# Altium schematic sheet Main.SchDoc
size A; Engineer: Hoang Pham; SheetNumber: 1; SheetTotal: 4; PageSetup: Record=PageOptions|CenterHorizontal=True|CenterVertical=True|PrintScale=1.00|XCorrection=1.00|YCorrection=1.00|PrintKind=1|BorderSize=5000000|LeftOffset=0|BottomOffset=0|Orientation=2|PaperLength=1000|PaperWidth=1000|Scale=100|PaperSource=7|PrintQuality=-3|MediaType=1|DitherType=10|PrintScaleMode=1|PaperKind=Letter 8.5"x11" 22x28cm|PaperIndex=1
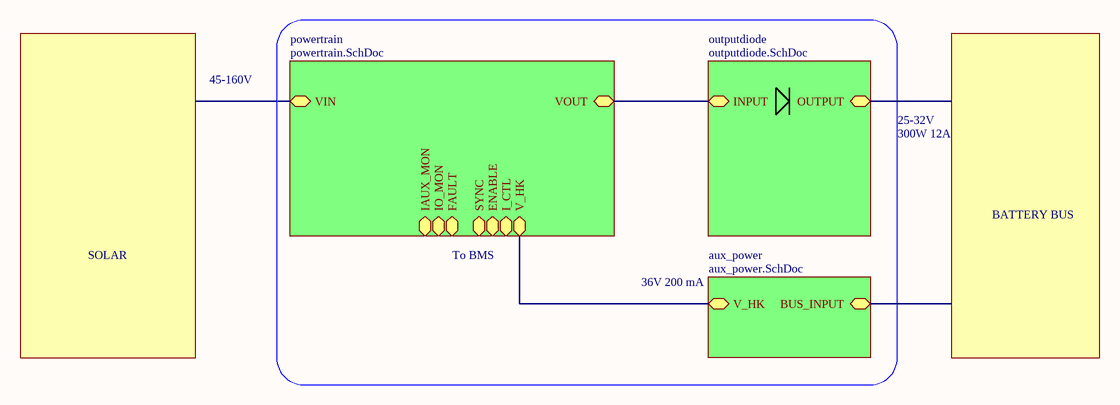
[diagram p0: Main.SchDoc]

## Sub-sheets
aux_power = aux_power.SchDoc: BUS_INPUT, V_HK
outputdiode = outputdiode.SchDoc: INPUT, OUTPUT
powertrain = powertrain.SchDoc: I_CTL, IAUX_MON, IO_MON, FAULT, VOUT, VIN, V_HK, SYNC, ENABLE

## Nets
(unnamed): sheet powertrain/VOUT, sheet outputdiode/INPUT
(unnamed): sheet powertrain/V_HK, sheet aux_power/V_HK

## Notes on the sheet
- 45-160V
- 25-32V
- 300W 12A
- SOLAR
- To BMS
- BATTERY BUS
- 36V 200 mA